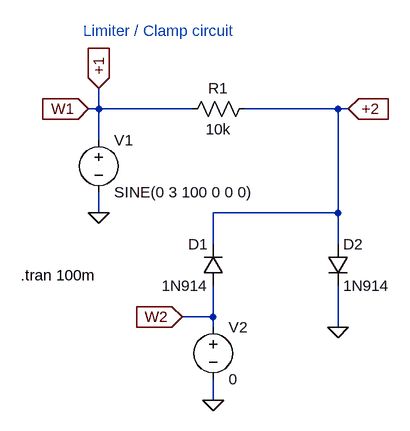
[diagram p0: schematic clamp_cir.asc]
clamp_cir.asc, the LTspice schematic file:
Version 4
SHEET 1 880 680
WIRE 64 -16 64 -48
WIRE 64 -16 48 -16
WIRE 208 -16 64 -16
WIRE 432 -16 288 -16
WIRE 448 -16 432 -16
WIRE 64 32 64 -16
WIRE 64 144 64 112
WIRE 432 144 432 -16
WIRE 432 144 240 144
WIRE 240 192 240 144
WIRE 432 192 432 144
WIRE 240 304 240 256
WIRE 240 304 192 304
WIRE 240 320 240 304
WIRE 432 320 432 256
WIRE 240 432 240 400
FLAG 432 320 0
FLAG 64 144 0
FLAG 240 432 0
FLAG 48 -16 W1
IOPIN 48 -16 In
FLAG 64 -48 +1
IOPIN 64 -48 In
FLAG 448 -16 +2
IOPIN 448 -16 In
FLAG 192 304 W2
IOPIN 192 304 In
SYMBOL res 304 -32 R90
WINDOW 0 0 56 VBottom 2
WINDOW 3 32 56 VTop 2
SYMATTR InstName R1
SYMATTR Value 10k
SYMBOL diode 256 256 R180
WINDOW 0 24 64 Left 2
WINDOW 3 24 0 Left 2
SYMATTR InstName D1
SYMATTR Value 1N914
SYMBOL diode 416 192 R0
SYMATTR InstName D2
SYMATTR Value 1N914
SYMBOL voltage 64 16 R0
WINDOW 123 0 0 Left 0
WINDOW 39 0 0 Left 0
SYMATTR InstName V1
SYMATTR Value SINE(0 3 100 0 0 0)
SYMBOL voltage 240 304 R0
WINDOW 123 0 0 Left 0
WINDOW 39 0 0 Left 0
SYMATTR InstName V2
SYMATTR Value 0
TEXT 40 -136 Left 2 ;Limiter / Clamp circuit
TEXT -56 240 Left 2 !.tran 100m

The netlist it stands for:
* clamp_cir.asc
R1 +2 +1 10k
D1 W2 +2 1N914
D2 +2 0 1N914
V1 +1 0 SINE(0 3 100 0 0 0)
V2 W2 0 0
.model D D
.lib standard.dio
* Limiter / Clamp circuit
.tran 100m
.backanno
.end